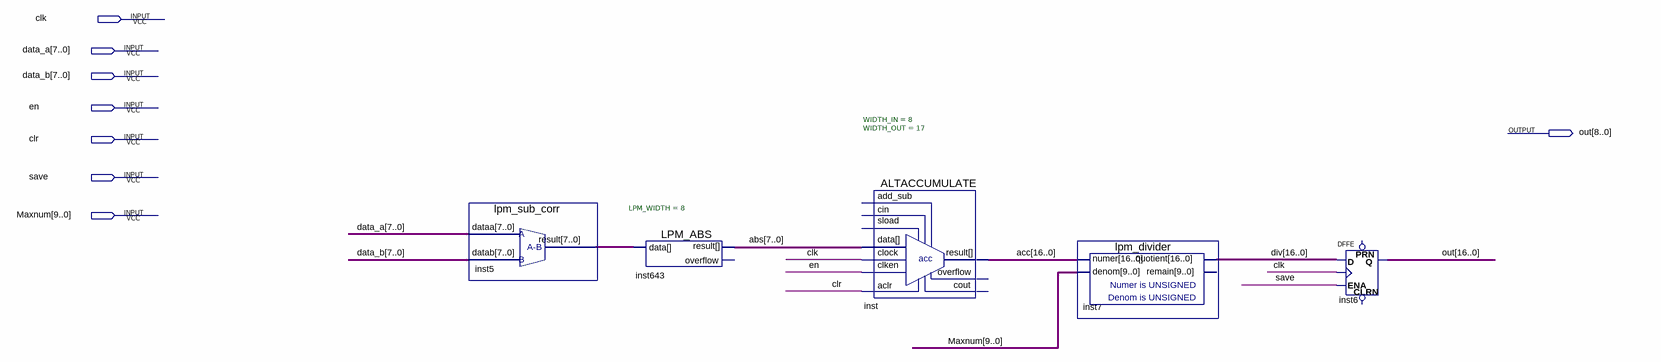
[diagram p0: schematic sheet]
// Quartus schematic sub_corr.bdf as structural Verilog: 5 symbols, 8 pins
module sub_corr (
  input  clk,
  input  [7:0] data_a,
  input  [7:0] data_b,
  input  en,
  input  clr,
  input  save,
  input  [9:0] Maxnum,
  output [16:0] out
);

  wire [7:0] abs, inst5_result;
  wire [16:0] acc, div;

  lpm_sub_corr inst5 (.dataa(data_a), .datab(data_b), .result(inst5_result));
  LPM_ABS #(.LPM_WIDTH(8)) inst643 (.data(inst5_result), .result(abs));  // open: overflow
  ALTACCUMULATE #(.WIDTH_IN(8), .WIDTH_OUT(17)) inst (
    .aclr(clr), .clock(clk), .clken(en), .data(abs), .result(acc));  // open: add_sub, cin, sload, cout, overflow
  lpm_divider inst7 (.numer(acc), .denom(Maxnum), .quotient(div));  // open: remain
  DFFE inst6[16:0] (.D(div), .CLK(clk), .ENA(save), .Q(out));  // open: PRN, CLRN
endmodule
